# EAGLE design LPF pcb (EAGLE 8.3.1)
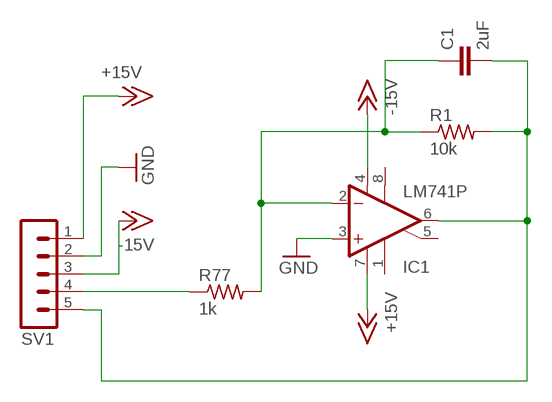
[diagram p0: schematic, sheet 1]

## Parts
C1  2uF  C-EUC0603  [C0603]
IC1  LM741P  [DIL08]
R1  10k  R-US_R0603  [R0603]
R77  1k  R-US_R0603  [R0603]
SV1  MA05-1  [MA05-1]

## Nets
+15V: IC1.7(V+) SV1.1
-15V: IC1.4(V-) SV1.3
GND: IC1.3(+IN) SV1.2
N$1: R77.1 SV1.4
N$2: C1.1 IC1.2(-IN) R1.1 R77.2
N$3: C1.2 IC1.6(OUT) R1.2 SV1.5
Unconnected: IC1.1(ON1) IC1.5(ON2) IC1.8(OPT)

## Library data of the parts
C1 = rcl:C-EU: CAPACITOR, European symbol
IC1 = linear:*741: OP AMP
R1 R77 = rcl:R-US_: RESISTOR, American symbol
SV1 = con-lstb:MA05-1: PIN HEADER; OC_FARNELL: unknown; OC_NEWARK: unknown

## Board
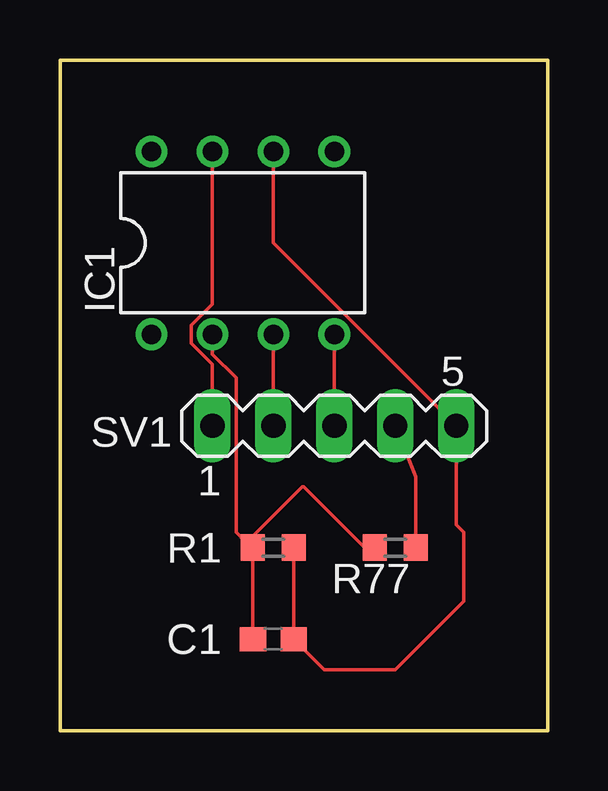
[diagram p1: board, top side]

Size 20.32 x 27.94 mm. Coordinates in mm from the lower left corner, seen from the top.
Outline: 0,27.94 0,0 20.32,0 20.32,27.94 0,27.94
Copper layers (1*16): Top 0.035mm / dielectric 1.5mm / Bottom 0.035mm
Design rules "default": minimum track width 6mil, minimum drill 0.35mm, track to track 6mil, track to pad 6mil, pad to pad 6mil, via to via 6mil, smd to smd 6mil, copper to edge 40mil, drill to drill 6mil, minimum pad ring 10mil, minimum via ring 8mil, stop-mask expansion 4mil, vias tented up to drill 0mil, thermal gap 10mil

### Footprints (pad centres in the part's own frame; a part is rotated, then mirrored left to right if it is on the bottom)
C0603 = smd 1.1 x 1: 1 -0.85,0; 2 0.85,0
DIL08 = drill 0.813 pad 1.27: 1 -3.81,-3.81; 2 -1.27,-3.81; 3 1.27,-3.81; 4 3.81,-3.81; 5 3.81,3.81; 6 1.27,3.81; 7 -1.27,3.81; 8 -3.81,3.81
R0603 = smd 1 x 1.1: 1 -0.85,0; 2 0.85,0
MA05-1 = drill 1.016 long: 1 -5.08,0; 2 -2.54,0; 3 0,0; 4 2.54,0; 5 5.08,0

### Placement (x,y rotation side)
C1  8.89,3.81 0 top
IC1  7.62,20.32 0 top
R1  8.89,7.62 0 top
R77  13.97,7.62 180 top
SV1  11.43,12.7 0 top

### Tracks (layer width: path | path; a pad name or v marks a point on that pad's centre or on a via)
+15V
  Top 0.152: IC1.7 6.35,17.77 5.46,16.88 5.46,16.14 6.35,15.25 SV1.1
-15V
  Top 0.152: IC1.4 SV1.3
GND
  Top 0.152: IC1.3 SV1.2
N$1
  Top 0.152: R77.1 14.82,10.58 SV1.4
N$2
  Top 0.152: R1.1 8.04,7.56 | 8.04,7.56 C1.1 | IC1.2 6.35,15.68 7.34,14.69 7.34,8.26 7.77,7.83 | 7.77,7.83 8.04,7.56 | R77.2 12.7,7.62 10.16,10.16 10.1,10.16 7.77,7.83
N$3
  Top 0.152: IC1.6 8.89,20.32 SV1.5 16.51,8.57 16.82,8.27 16.82,5.39 13.97,2.54 11.01,2.54 C1.2 R1.2